# EAGLE design main (EAGLE 7.6.0)
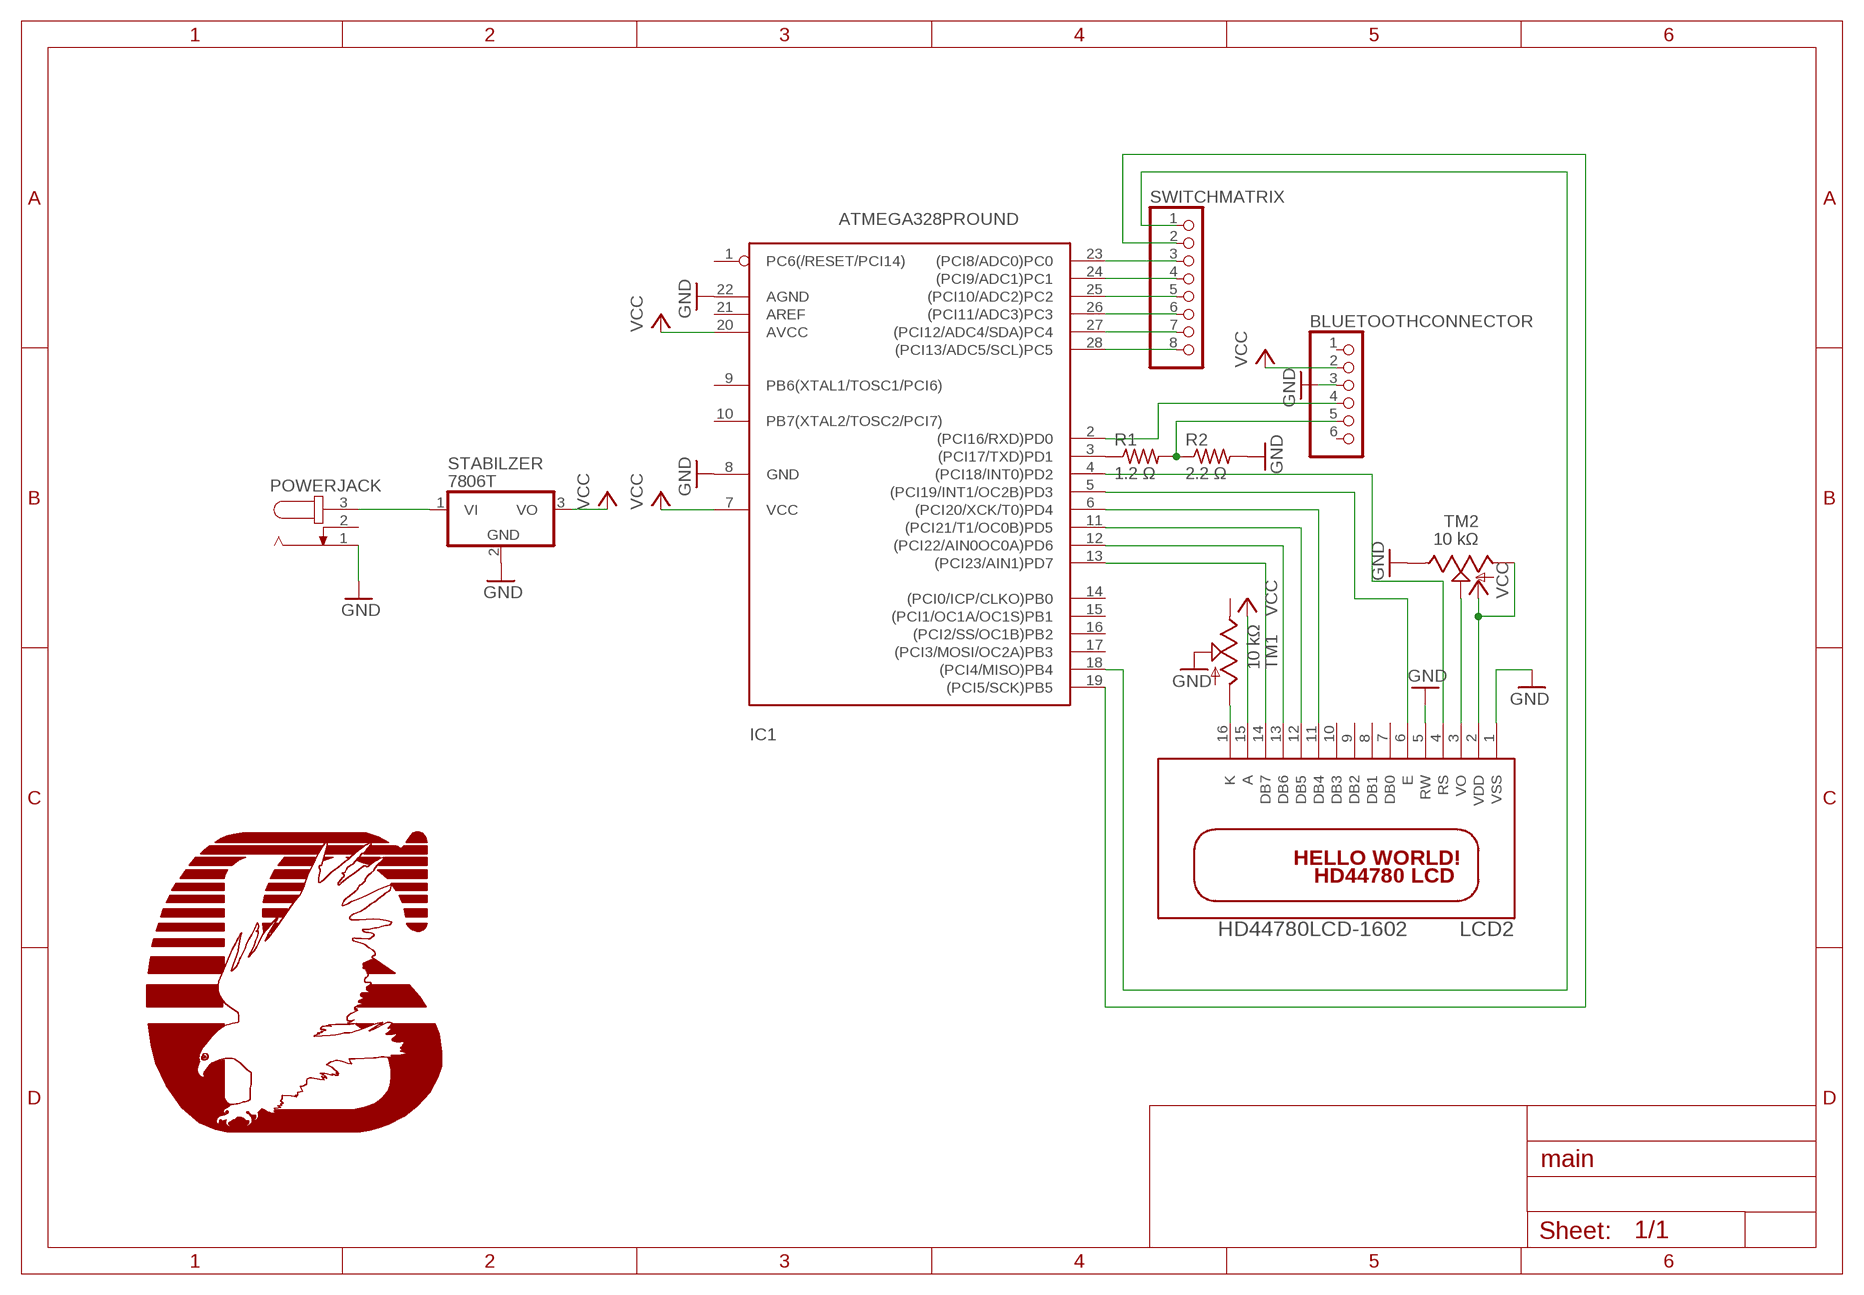
[diagram p0: schematic, sheet 1]

## Parts
BLUETOOTHCONNECTOR  PINHD-1X6B  [1X06-BIG]
IC1  ATMEGA328PROUND  [DIL28-3-ROUND]
LCD2  HD44780LCD-1602  [LCD1602]
POWERJACK  JACK-PLUG0  [SPC4077]
R1  1.2 Ω  R-US_0207/10  [0207/10]
R2  2.2 Ω  R-US_0207/10  [0207/10]
STABILZER  7806T  [TO220H]
SWITCHMATRIX  PINHD-1X8BIG  [1X08-BIG]
TM1  10 kΩ  TRIM  [6MM]
TM2  10 kΩ  TRIM  [6MM]

## Nets
GND: BLUETOOTHCONNECTOR.3 IC1.8(GND) IC1.22(AGND) LCD2.1(VSS) LCD2.5(RW) POWERJACK.1 R2.2 STABILZER.2(GND) TM1.S TM2.E
N$1: BLUETOOTHCONNECTOR.4 IC1.2((PCI16/RXD)PD0)
N$2: IC1.3((PCI17/TXD)PD1) R1.1
N$3: BLUETOOTHCONNECTOR.5 R1.2 R2.1
N$4: IC1.4((PCI18/INT0)PD2) LCD2.4(RS)
N$5: IC1.5((PCI19/INT1/OC2B)PD3) LCD2.6(E)
N$6: IC1.13((PCI23/AIN1)PD7) LCD2.14(DB7)
N$7: IC1.12((PCI22/AIN0OC0A)PD6) LCD2.13(DB6)
N$8: IC1.11((PCI21/T1/OC0B)PD5) LCD2.12(DB5)
N$9: LCD2.16(K) TM1.A
N$10: LCD2.3(VO) TM2.S
N$11: IC1.6((PCI20/XCK/T0)PD4) LCD2.11(DB4)
N$12: IC1.23((PCI8/ADC0)PC0) SWITCHMATRIX.3
N$13: IC1.24((PCI9/ADC1)PC1) SWITCHMATRIX.4
N$14: IC1.25((PCI10/ADC2)PC2) SWITCHMATRIX.5
N$15: IC1.26((PCI11/ADC3)PC3) SWITCHMATRIX.6
N$16: IC1.27((PCI12/ADC4/SDA)PC4) SWITCHMATRIX.7
N$17: IC1.28((PCI13/ADC5/SCL)PC5) SWITCHMATRIX.8
N$18: IC1.18((PCI4/MISO)PB4) SWITCHMATRIX.1
N$19: IC1.19((PCI5/SCK)PB5) SWITCHMATRIX.2
N$34: POWERJACK.3 STABILZER.1(VI)
VCC: BLUETOOTHCONNECTOR.2 IC1.7(VCC) IC1.20(AVCC) LCD2.2(VDD) LCD2.15(A) STABILZER.3(VO) TM2.A
Unconnected: BLUETOOTHCONNECTOR.1 BLUETOOTHCONNECTOR.6 IC1.1(PC6(/RESET/PCI14)) IC1.9(PB6(XTAL1/TOSC1/PCI6)) IC1.10(PB7(XTAL2/TOSC2/PCI7)) IC1.14((PCI0/ICP/CLKO)PB0) IC1.15((PCI1/OC1A/OC1S)PB1) IC1.16((PCI2/SS/OC1B)PB2) IC1.17((PCI3/MOSI/OC2A)PB3) IC1.21(AREF) LCD2.7(DB0) LCD2.8(DB1) LCD2.9(DB2) LCD2.10(DB3) POWERJACK.2 TM1.E

## Library data of the parts
BLUETOOTHCONNECTOR = adafruit:PINHD-1X6: PIN HEADER
IC1 = atmega328:ATMEGA328*P: MICROCONTROLLER 32 kBytes FLASH 2 kBytes SRAM 1 kBytes EEPROM USART 8-channel 10 bit ADC
LCD2 = adafruit:HD44780LCD: HD44780 LCD Standard character type LCDs, available in sizes from 8x1 to 40x4!
POWERJACK = con-jack:JACK-PLUG: DC POWER JACK Power Jack, DC, Right Angle, Through Hole, Rated 5A at 16VDC, PC Terminals Distributor: Farnell (www.Farnell.de) Drawing: 84N1161.pdf / 84N1162.pdf Manufacturer: SPC Technology (www.spctechnology.com) Type: SPC4077 / SPC 4078; OC_FARNELL: unknown; OC_NEWARK: unknown
R1 R2 = adafruit:R-US_: RESISTOR, American symbol
STABILZER = adafruit:78*: Positive VOLTAGE REGULATOR Added bigger pads to the TO-92 package
SWITCHMATRIX = adafruit:PINHD-1X8: PIN HEADER
TM1 TM2 = adafruit:TRIM

## Board
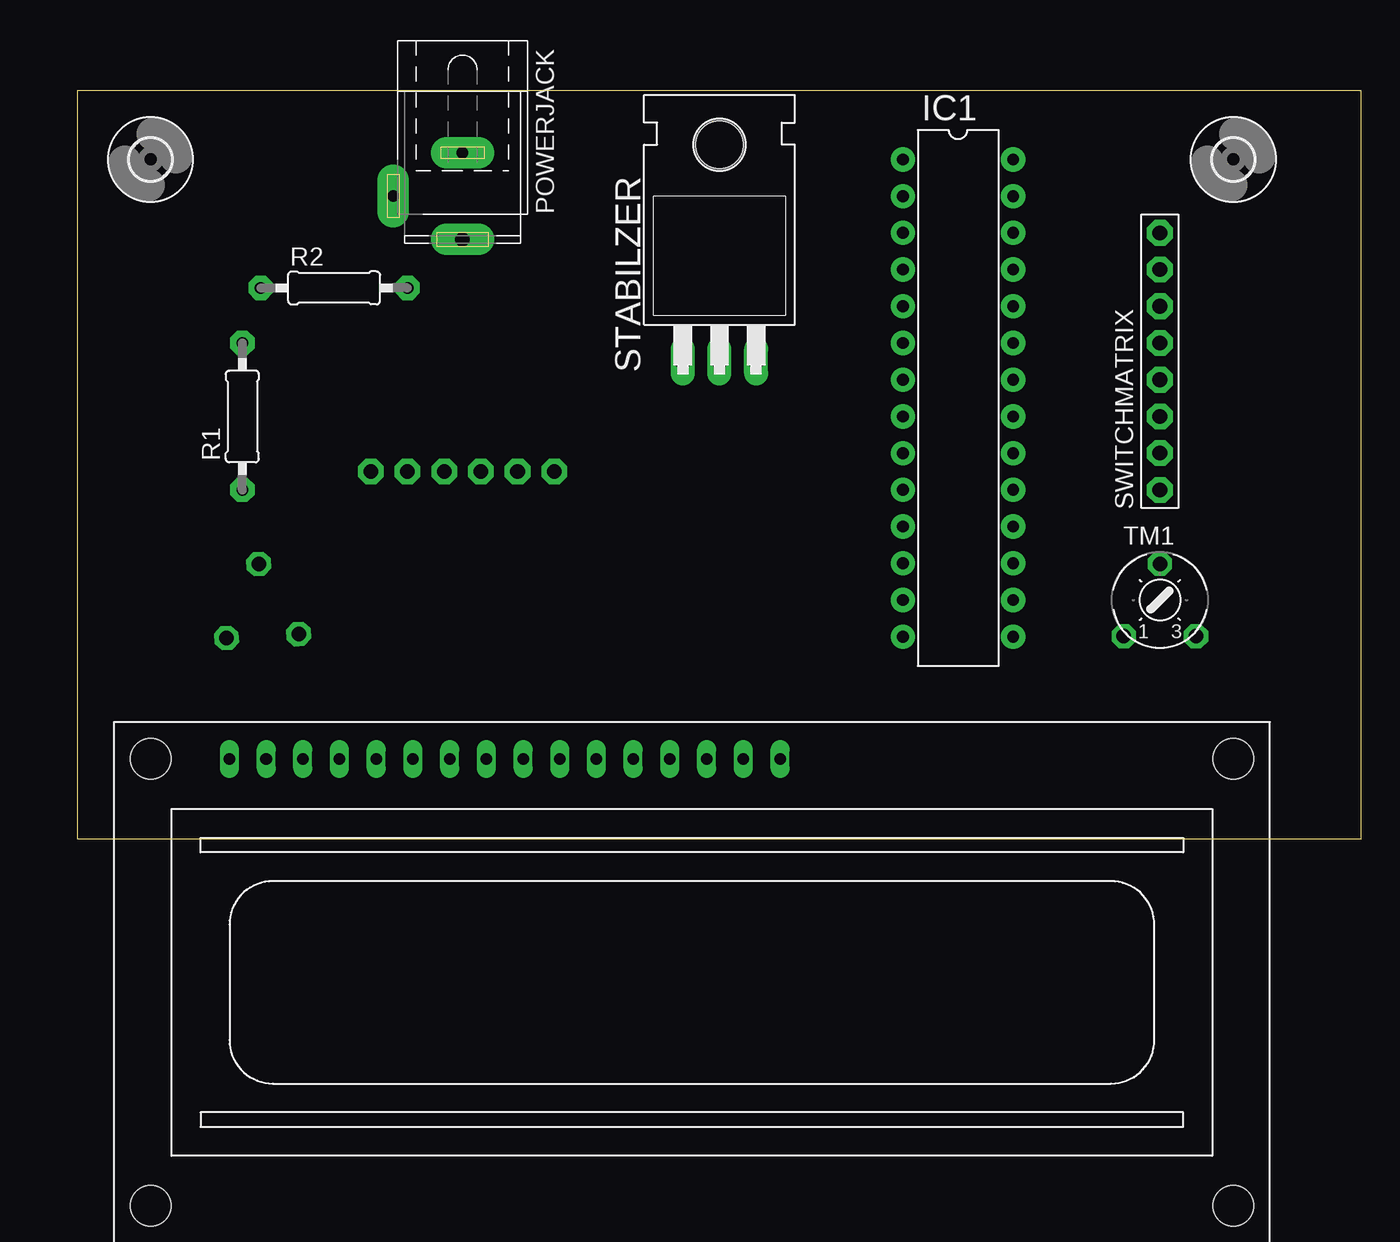
[diagram p1: board, top side]
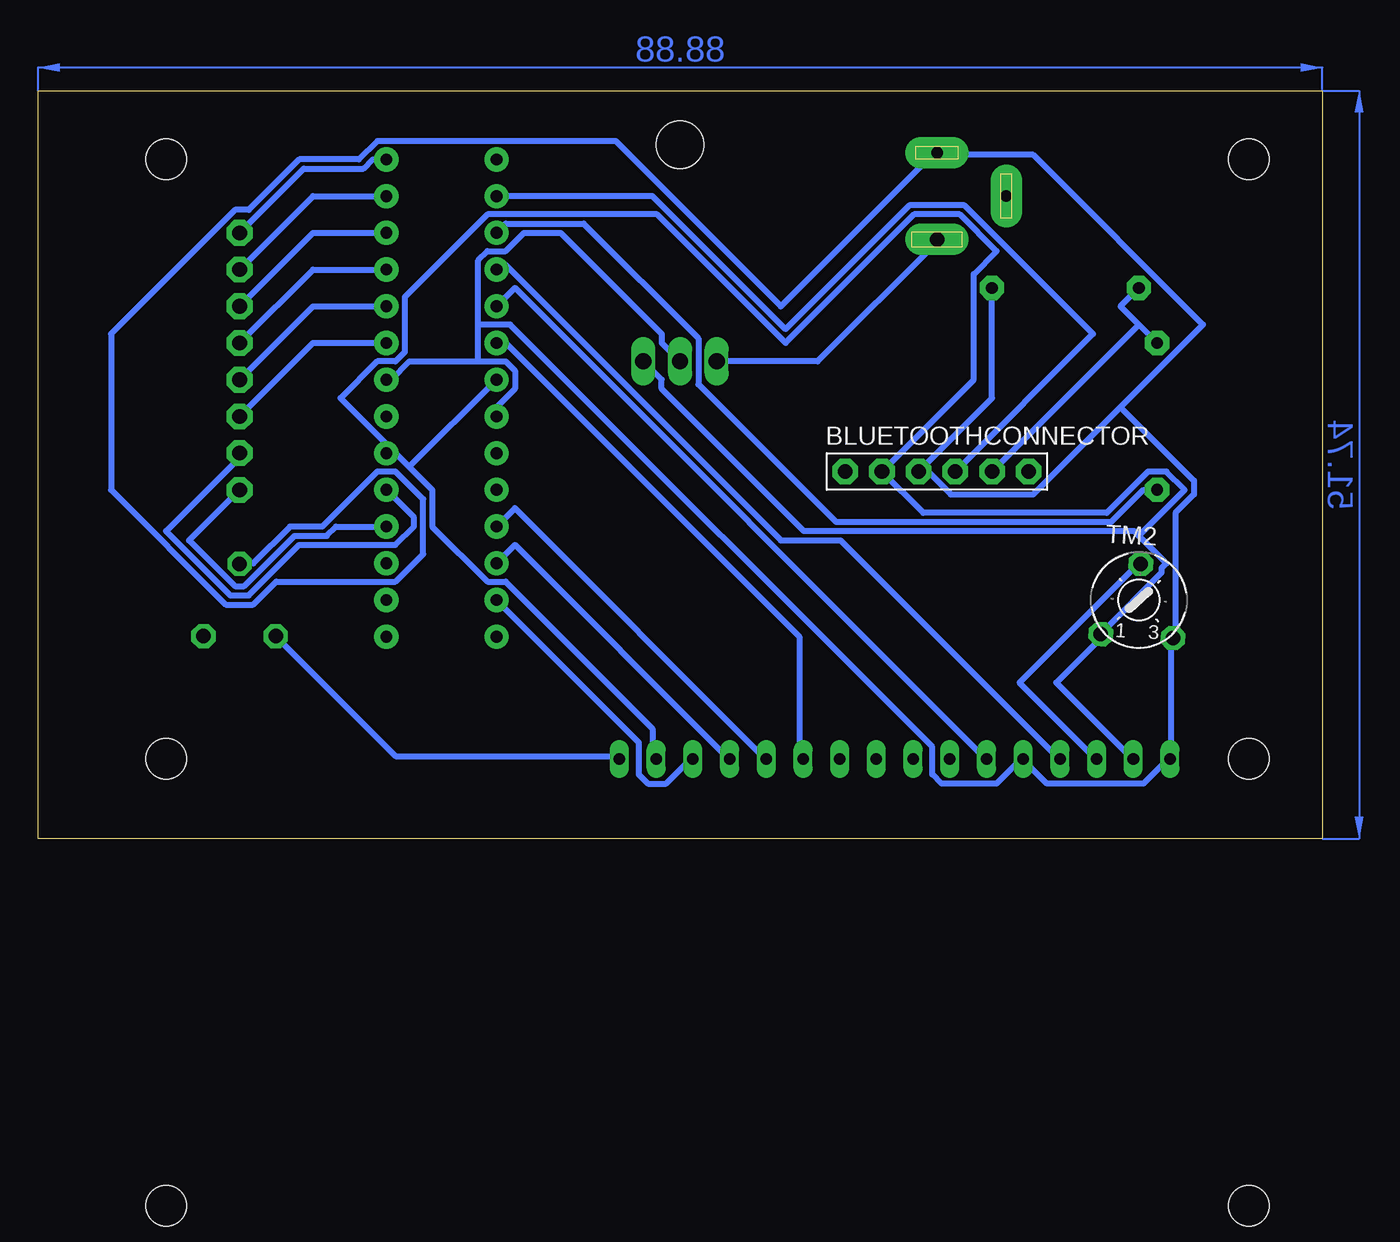
[diagram p2: board, bottom side, seen from below]

Size 88.88 x 51.74 mm. Coordinates in mm from the lower left corner, seen from the top.
Outline: 88.88,0 88.88,51.74 0,51.74 0,0 88.88,0
Copper layers (1*16): Top 0.035mm / dielectric 1.5mm / Bottom 0.035mm
Design rules "default *": minimum track width 0.4mm, minimum drill 24mil, track to track 0.2mm, track to pad 0.2mm, pad to pad 0.2mm, via to via 0.2mm, smd to smd 0.2mm, copper to edge 40mil, drill to drill 8mil, minimum pad ring 10mil, minimum via ring 8mil, stop-mask expansion 4mil, vias tented up to drill 0mil, thermal gap 10mil

### Footprints (pad centres in the part's own frame; a part is rotated, then mirrored left to right if it is on the bottom)
1X06-BIG = drill 1.016 pad 1.778 octagon: 1 -6.35,0; 2 -3.81,0; 3 -1.27,0; 4 1.27,0; 5 3.81,0; 6 6.35,0
DIL28-3-ROUND = drill 0.813 pad 1.676: 1 -16.51,-3.81; 2 -13.97,-3.81; 3 -11.43,-3.81; 4 -8.89,-3.81; 5 -6.35,-3.81; 6 -3.81,-3.81; 7 -1.27,-3.81; 8 1.27,-3.81; 9 3.81,-3.81; 10 6.35,-3.81; 11 8.89,-3.81; 12 11.43,-3.81; 13 13.97,-3.81; 14 16.51,-3.81; 15 16.51,3.81; 16 13.97,3.81; 17 11.43,3.81; 18 8.89,3.81; 19 6.35,3.81; 20 3.81,3.81; 21 1.27,3.81; 22 -1.27,3.81; 23 -3.81,3.81; 24 -6.35,3.81; 25 -8.89,3.81; 26 -11.43,3.81; 27 -13.97,3.81; 28 -16.51,3.81
LCD1602 = drill 0.8 long: 1 8,33.46; 2 10.54,33.46; 3 13.08,33.46; 4 15.62,33.46; 5 18.16,33.46; 6 20.7,33.46; 7 23.24,33.46; 8 25.78,33.46; 9 28.32,33.46; 10 30.86,33.46; 11 33.4,33.46; 12 35.94,33.46; 13 38.48,33.46; 14 41.02,33.46; 15 43.56,33.46; 16 46.1,33.46 | hole 2.8: 2.54,2.54; 2.54,33.46; 77.46,33.46; 77.46,2.54
SPC4077 = drill 0.8 pad 2.184 long: 1 -3,0; 2 0,-4.8 | drill 1 pad 2.184 long: 3 3,0
0207/10 = drill 0.813 pad 1.676 octagon: 1 -5.08,0; 2 5.08,0
TO220H = drill 1.118 long: 1 -2.54,-10.16; 2 0,-10.16; 3 2.54,-10.16 | hole 3.302: 0,4.826
1X08-BIG = drill 1.016 pad 1.778 octagon: 1 -8.89,0; 2 -6.35,0; 3 -3.81,0; 4 -1.27,0; 5 1.27,0; 6 3.81,0; 7 6.35,0; 8 8.89,0
6MM = drill 1 pad 1.676 octagon: A -2.5,-2.5; E 2.5,-2.5; S 0,2.5
2,8 = hole 2.8: 0,0

### Placement (x,y rotation side)
BLUETOOTHCONNECTOR  26.67,25.4 0 bottom
IC1  60.96,30.48 270 top
LCD2  2.54,-27.94 0 top
POWERJACK  26.67,44.45 270 top
R1  11.43,29.21 90 top
R2  17.78,38.1 0 top
STABILZER  44.45,43.18 0 top
SWITCHMATRIX  74.93,33.02 90 top
TM1  74.93,16.51 0 top
TM2  12.7,16.51 356.9 bottom
U$1  [2,8]  5.08,46.99 0 top
U$2  [2,8]  80.01,46.99 0 top

### Tracks (layer width: path | path; a pad name or v marks a point on that pad's centre or on a via)
GND
  Bottom 0.4: TM1.S 74.93,19.05 73.98,19.05 71.44,21.59 69.22,21.59 65.41,25.4 64.14,25.4 62.23,23.49 62.23,19.68 64.14,17.78 72.39,17.78 73.98,16.19 75.88,16.19 83.82,24.13 83.82,34.92 75.25,43.5 74.3,43.5 70.8,46.99 66.67,46.99 65.41,48.26 48.9,48.26 37.47,36.83 26.67,47.62 POWERJACK.1 26.67,47.31 20,47.31 8.26,35.56 13.97,29.84 | IC1.8 57.15,29.84 55.88,31.11 55.88,32.38 56.52,33.02 58.42,33.02 | 58.42,33.02 63.18,33.02 64.45,31.75 IC1.22 | STABILZER.2 45.72,34.29 45.72,34.92 52.7,41.91 55.24,41.91 56.52,40.64 57.78,40.64 58.42,40.01 58.42,35.56 | 58.42,33.02 58.42,35.56 | R2.2 22.86,30.48 27.62,25.72 | 13.97,29.84 8.89,24.77 8.89,23.81 10.16,22.54 10.16,13.97 TM2.E 10.48,13.65 10.48,5.71 LCD2.1 10.79,5.4 12.38,3.81 19.05,3.81 20.64,5.4 LCD2.5 20.95,5.4 22.54,3.81 26.35,3.81 26.99,4.45 26.99,6.35 56.2,35.56 58.42,35.56 | 13.97,29.84 20,23.81 25.72,23.81 27.62,25.72 | 27.62,25.72 BLUETOOTHCONNECTOR.3
N$1
  Bottom 0.4: IC1.2 46.35,44.45 37.15,35.24 28.57,43.81 24.77,43.81 15.88,34.92 BLUETOOTHCONNECTOR.4
N$2
  Bottom 0.4: R1.1 12.38,24.13 14.61,21.91 33.66,21.91 43.18,31.43 43.18,34.61 51.12,42.55 56.52,42.55 IC1.3
N$3
  Bottom 0.4: 12.7,35.56 13.97,36.83 R2.1 | 12.7,35.56 R1.2 | 12.7,35.56 BLUETOOTHCONNECTOR.5
N$4
  Bottom 0.4: IC1.4 56.83,39.37 56.52,39.69 37.47,20.64 33.34,20.64 18.41,5.71 LCD2.4
N$5
  Bottom 0.4: IC1.5 55.88,38.1 23.5,5.71 LCD2.6
N$6
  Bottom 0.4: IC1.13 47.31,6.67 47.31,4.45 46.67,3.81 45.4,3.81 43.81,5.4 LCD2.14
N$7
  Bottom 0.4: IC1.12 55.88,20.32 41.27,5.71 LCD2.13
N$8
  Bottom 0.4: IC1.11 55.88,22.86 38.73,5.71 LCD2.12
N$9
  Bottom 0.4: TM1.A 64.14,5.71 48.9,5.71 LCD2.16
N$10
  Bottom 0.4: LCD2.3 15.88,5.71 20.95,10.8 12.7,19.05 TM2.S
N$11
  Bottom 0.4: IC1.6 56.83,34.61 36.2,13.97 36.2,5.71 LCD2.11
N$12
  Bottom 0.4: IC1.23 69.85,34.29 SWITCHMATRIX.3
N$13
  Bottom 0.4: IC1.24 69.85,36.83 SWITCHMATRIX.4
N$14
  Bottom 0.4: IC1.25 69.85,39.37 SWITCHMATRIX.5
N$15
  Bottom 0.4: IC1.26 69.85,41.91 SWITCHMATRIX.6
N$16
  Bottom 0.4: IC1.27 69.85,44.45 SWITCHMATRIX.7
N$17
  Bottom 0.4: IC1.28 65.72,46.99 66.36,46.35 70.48,46.35 SWITCHMATRIX.8
N$18
  Bottom 0.4: IC1.18 68.26,21.59 68.9,20.95 71.12,20.95 74.61,17.46 75.25,17.46 78.42,20.64 SWITCHMATRIX.1
N$19
  Bottom 0.4: IC1.19 62.87,22.22 62.87,21.59 64.14,20.32 70.8,20.32 74.3,16.83 75.56,16.83 80.01,21.27 74.93,26.35 SWITCHMATRIX.2
N$34
  Bottom 0.4: STABILZER.1 34.92,33.02 26.67,41.27 POWERJACK.3
VCC
  Bottom 0.4: 64.45,26.99 63.18,25.72 | 63.18,25.72 61.59,24.13 61.59,21.59 57.78,17.78 56.52,17.78 46.35,7.62 46.35,5.71 LCD2.15 | 63.18,25.72 IC1.7 | LCD2.2 13.34,5.71 18.41,10.8 15.24,13.97 TM2.A 15.24,14.29 11.11,18.41 11.11,18.73 10.79,19.05 12.7,20.95 | STABILZER.3 45.72,31.75 45.72,31.11 35.88,21.27 13.02,21.27 12.7,20.95 | 12.7,20.95 9.53,24.13 10.79,25.4 12.06,25.4 14.92,22.54 27.62,22.54 BLUETOOTHCONNECTOR.2 24.13,31.75 24.13,39.05 22.54,40.64 25.08,43.18 28.26,43.18 37.15,34.29 46.04,43.18 57.78,43.18 63.5,37.46 63.5,33.66 64.14,33.02 65.41,33.02 67.94,30.48 64.45,26.99 | 64.45,26.99 IC1.20
(copper drawn outside any net)
  shapes: Bottom area x2